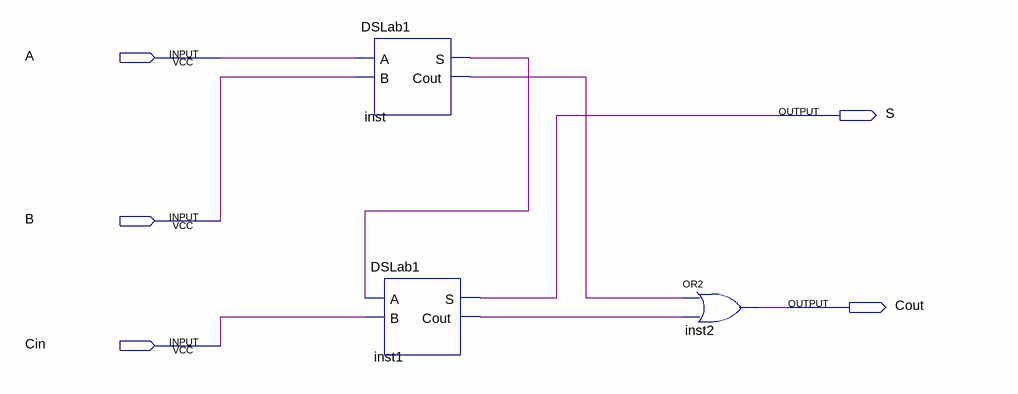
[diagram p0: schematic sheet]
// Quartus schematic Block2.bdf as structural Verilog: 3 symbols, 5 pins
module Block2 (
  input  A,
  input  B,
  input  Cin,
  output S,
  output Cout
);

  wire inst1_cout, inst_cout, inst_s;

  DSLab1 inst (.A(A), .B(B), .S(inst_s), .Cout(inst_cout));
  DSLab1 inst1 (.A(inst_s), .B(Cin), .S(S), .Cout(inst1_cout));
  or inst2 (Cout, inst_cout, inst1_cout);
endmodule
